# Altium project ant2-usb-c-lipo-charger.PrjPcb
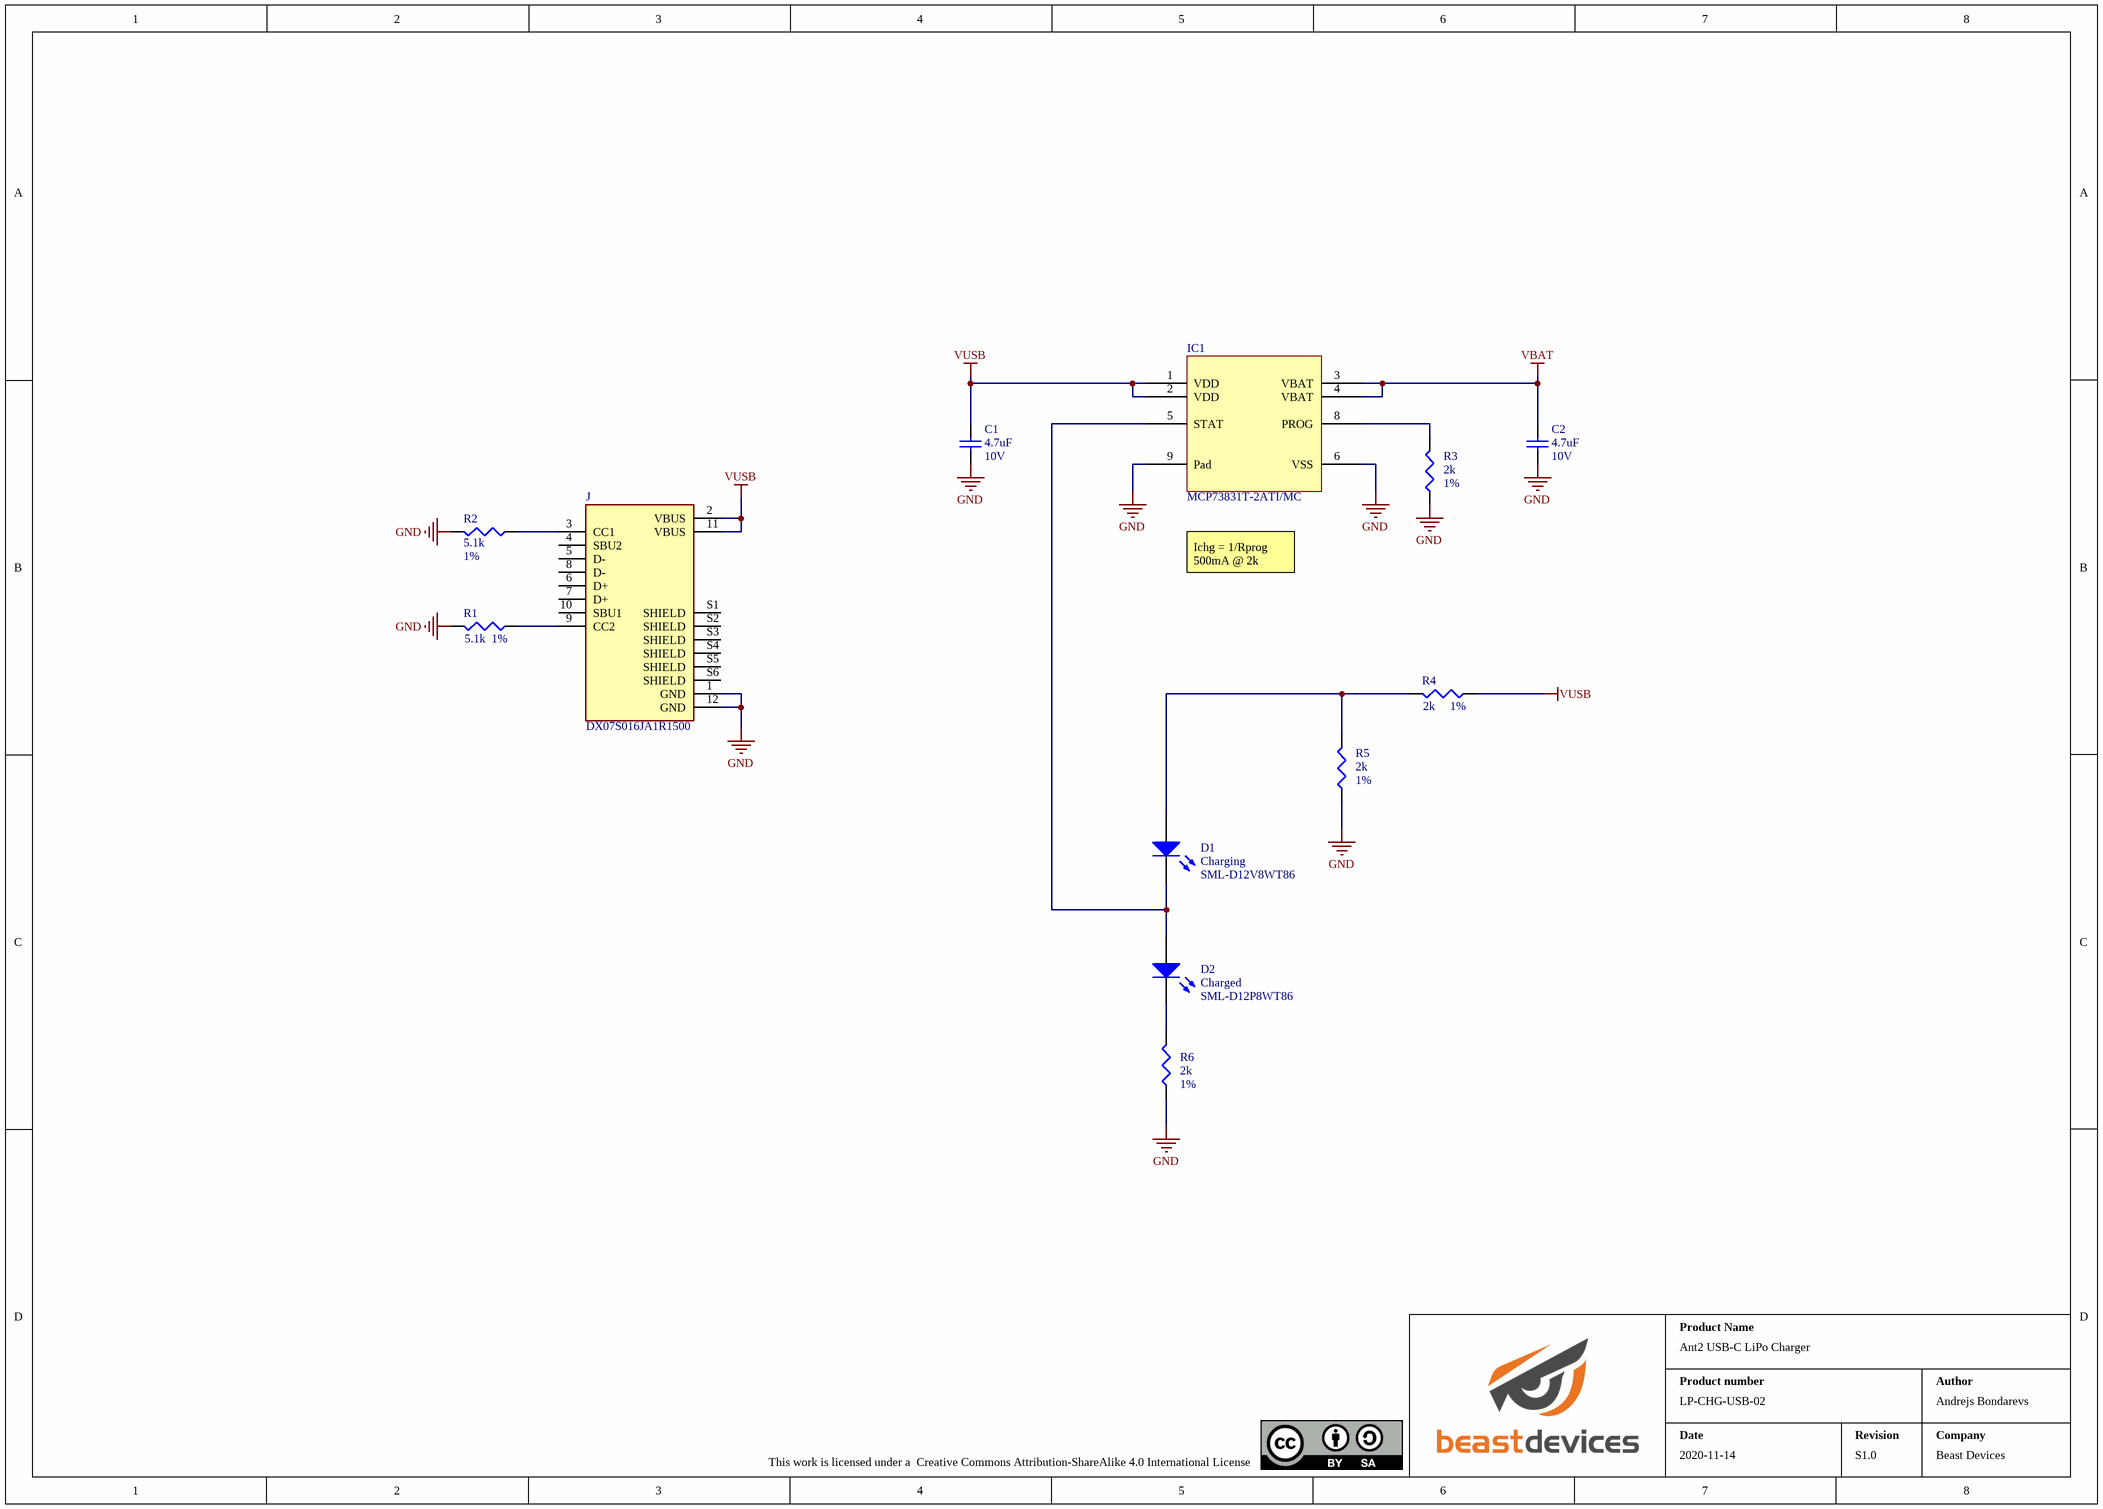
[diagram p0: ant2-usb-c-lipo-charger.SchDoc]
1 sheet, 12 parts. Net scope: global (net labels, ports and power ports of the same name join across sheets).

## Sheet ant2-usb-c-lipo-charger.SchDoc
size A3; Author: Andrejs Bondarevs; CompanyName: Beast Devices; DrawnBy: Andrejs Bondarevs; Engineer: Andrejs Bondarevs; Revision: 1.5; PageSetup: Record=PageOptions|CenterHorizontal=True|CenterVertical=True|PrintScale=0.73|XCorrection=1.00|YCorrection=1.00|PrintKind=0|BorderSize=5000000|LeftOffset=0|BottomOffset=0|Orientation=2|PaperLength=1000|PaperWidth=1000|Scale=100|PaperSource=7|PrintQuality=600|MediaType=1|DitherType=10|PrintScaleMode=1|PaperKind=A4|PaperIndex=9; ProjectName: Caiman Supercapacitor Charger

### Parts
C1  value 4.7uF  Voltage: 10V  [1608[0603]]  (hidden comment: Cap)
C2  value 4.7uF  Voltage: 10V  [1608[0603]]  (hidden comment: Cap)
D1  Charging  Part Number: SML-D12V8WT86  [LED0603]
D2  Charged  Part Number: SML-D12P8WT86  [LED0603]
IC1  Part Number: MCP73831T-2ATI/MC  [DFN2x3_8Lead]  (hidden comment: MCP73831)
J  DX07S016JA1R1500  [JAE_DX07S016JA1R1500]
R1  value 5.1k  Tolerance: 1%  [J1-0603]  (hidden comment: Res3)
R2  value 5.1k  Tolerance: 1%  [J1-0603]  (hidden comment: Res3)
R3  value 2k  Tolerance: 1%  [J1-0603]  (hidden comment: Res3)
R4  value 2k  Tolerance: 1%  [J1-0603]
R5  value 2k  Tolerance: 1%  [J1-0603]
R6  value 2k  Tolerance: 1%  [J1-0603]

### Nets
GND: C1.1 C2.1 IC1.6(VSS) IC1.9(Pad) J.1(GND) J.12(GND) R1.2 R2.1 R3.1 R5.1 R6.1
VBAT: C2.2 IC1.3(VBAT) IC1.4(VBAT)
VUSB: C1.2 IC1.1(VDD) IC1.2(VDD) J.2(VBUS) J.11(VBUS) R4.1
NetD1_1: D1.1(A) R4.2 R5.2
NetD1_2: D1.2(K) D2.1(A) IC1.5(STAT)
NetD2_2: D2.2(K) R6.2
NetIC1_8: IC1.8(PROG) R3.2
NetJ_3: J.3(CC1) R2.2
NetJ_9: J.9(CC2) R1.1

Not connected (* = marked no-connect by the designer): J 4(SBU2) 5(D-) 6(D+) 7(D+) 8(D-) 10(SBU1) S1(SHIELD) S2(SHIELD) S3(SHIELD) S4(SHIELD) S5(SHIELD) S6(SHIELD)

### Notes on the sheet
- Ichg = 1/Rprog
  500mA @ 2k
- Ant2 USB-C LiPo Charger
- Product Name
- Product number
- Author
- 2020-11-14
- LP-CHG-USB-02
- Date
- S1.0
- Revision
- Andrejs Bondarevs
- Beast Devices
- Company
- This work is licensed under a  Creative Commons Attribution-ShareAlike 4.0 International License

### Library data of the parts
C1 C2 = Cap Semi: Capacitor (Semiconductor SIM Model); Manufacturer: TDK; Part Number: C1608X5R1A475K080AE; Tolerance: 10%; Dielectric: X5R
  C1: Published: 8-Jun-2000
D1 = LED2: 0603 SMD LED RED; Manufacturer: ROHM Semiconductor
D2 = LED2: 0603 SMD LED Green; Manufacturer: ROHM Semiconductor
IC1 = MCP73831: Manufacturer: Microchip
J = DX07S016JA1R1500: USB-C (USB TYPE-C) USB 2.0 Receptacle Connector 24 (16+8 Dummy) Position Surface Mount, Right Angle; Through Hole; Manufacturer: JAE Electronics; Value: *; Price: None; Package: None; Availability: Unavailable; Part Number: DX07S016JA1R1500; DigiKey-Purchase-URL: https://snapeda.com/shop?store=DigiKey&id=4551013; SnapEDA_Link: https://www.snapeda.com/parts/DX07S016JA1R1500/JAE%20Electronics/view-part/4551013/?ref=snap
R1 = Res3: Resistor; Manufacturer: Yageo; Part Number: RC0603FR-075K1L
R2 = Res3: Resistor; Part Number: RC0603FR-075K1L; Manufacturer: Yageo
R3 R5 R6 = Res3: Resistor; Manufacturer: Yageo; Part Number: RC0603FR-072KL
R4 = Res3: Resistor; Manufacturer: Vishay; Part Number: RC0603FR-072KL